# Altium schematic sheet Pizza BASE.SchDoc: Pizza CPU BASE
size A4; Author: Giovanni Minotti; SheetNumber: 1; SheetTotal: 2; ENG_APP_DATE: --/--/--; DSN_APP_DATE: --/--/--; CHK_APP_DATE: --/--/--
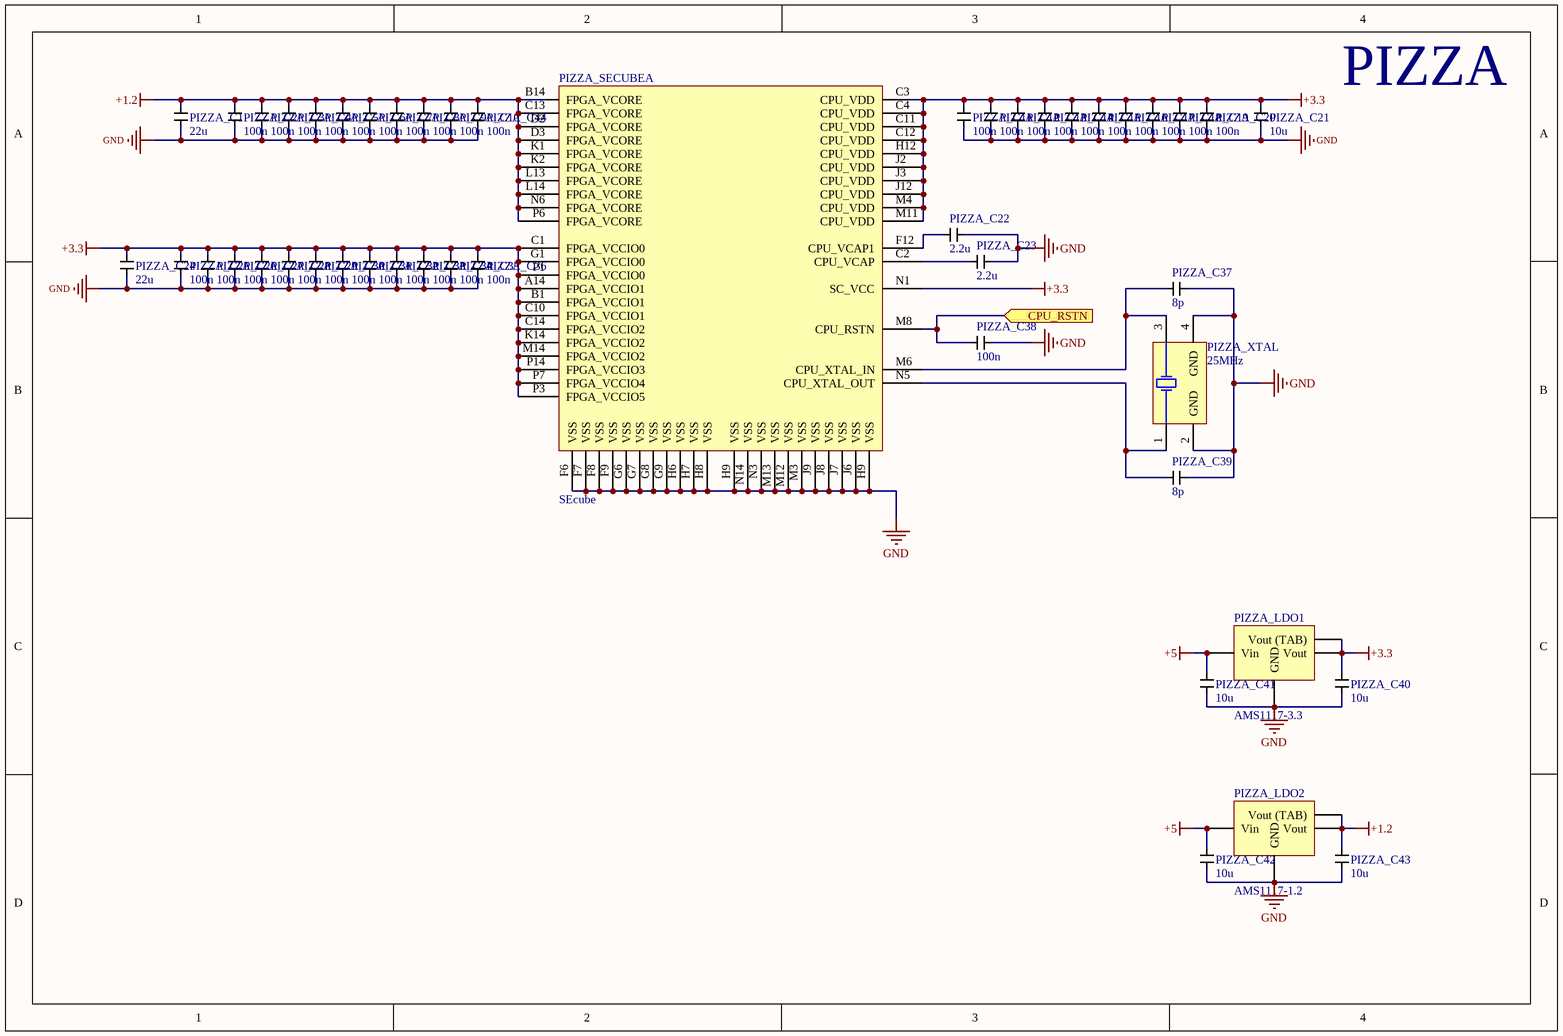
[diagram p0: Pizza BASE.SchDoc]

## Parts
PIZZA_C1  22u  [C0402]
PIZZA_C2  100n  [C0201]
PIZZA_C3  100n  [C0201]
PIZZA_C4  100n  [C0201]
PIZZA_C5  100n  [C0201]
PIZZA_C6  100n  [C0201]
PIZZA_C7  100n  [C0201]
PIZZA_C8  100n  [C0201]
PIZZA_C9  100n  [C0201]
PIZZA_C10  100n  [C0201]
PIZZA_C11  100n  [C0201]
PIZZA_C12  100n  [C0201]
PIZZA_C13  100n  [C0201]
PIZZA_C14  100n  [C0201]
PIZZA_C15  100n  [C0201]
PIZZA_C16  100n  [C0201]
PIZZA_C17  100n  [C0201]
PIZZA_C18  100n  [C0201]
PIZZA_C19  100n  [C0201]
PIZZA_C20  100n  [C0201]
PIZZA_C21  10u  [C0402]
PIZZA_C22  2.2u  [C0402]
PIZZA_C23  2.2u  [C0402]
PIZZA_C24  22u  [C0402]
PIZZA_C25  100n  [C0201]
PIZZA_C26  100n  [C0201]
PIZZA_C27  100n  [C0201]
PIZZA_C28  100n  [C0201]
PIZZA_C29  100n  [C0201]
PIZZA_C30  100n  [C0201]
PIZZA_C31  100n  [C0201]
PIZZA_C32  100n  [C0201]
PIZZA_C33  100n  [C0201]
PIZZA_C34  100n  [C0201]
PIZZA_C35  100n  [C0201]
PIZZA_C36  100n  [C0201]
PIZZA_C37  8p  [C0402]
PIZZA_C38  100n  [C0201]
PIZZA_C39  8p  [C0402]
PIZZA_C40  10u  [C0402]
PIZZA_C41  10u  [C0402]
PIZZA_C42  10u  [C0402]
PIZZA_C43  10u  [C0402]
PIZZA_C44  100n  [C0201]
PIZZA_LDO1  AMS1117-3.3  [SOT-223]
PIZZA_LDO2  AMS1117-1.2  [SOT-223]
PIZZA_SECUBE  SEcube  [SEcube]  (part A of 4)
PIZZA_XTAL  25MHz  [TSX-3225]

## Ports
CPU_RSTN (in, see Pizza IO[1C], Pizza IO[4D])

## Nets
+1.2: PIZZA_C1.2 PIZZA_C2.2 PIZZA_C3.2 PIZZA_C4.2 PIZZA_C5.2 PIZZA_C6.2 PIZZA_C7.2 PIZZA_C8.2 PIZZA_C9.2 PIZZA_C10.2 PIZZA_C43.2 PIZZA_C44.2 PIZZA_LDO2.3(Vout) PIZZA_LDO2.4(Vout_(TAB)) PIZZA_SECUBE.B14(FPGA_VCORE) PIZZA_SECUBE.C13(FPGA_VCORE) PIZZA_SECUBE.D2(FPGA_VCORE) PIZZA_SECUBE.D3(FPGA_VCORE) PIZZA_SECUBE.K1(FPGA_VCORE) PIZZA_SECUBE.K2(FPGA_VCORE) PIZZA_SECUBE.L13(FPGA_VCORE) PIZZA_SECUBE.L14(FPGA_VCORE) PIZZA_SECUBE.N6(FPGA_VCORE) PIZZA_SECUBE.P6(FPGA_VCORE)
+3.3: PIZZA_C11.2 PIZZA_C12.2 PIZZA_C13.2 PIZZA_C14.2 PIZZA_C15.2 PIZZA_C16.2 PIZZA_C17.2 PIZZA_C18.2 PIZZA_C19.2 PIZZA_C20.2 PIZZA_C21.2 PIZZA_C24.2 PIZZA_C25.2 PIZZA_C26.2 PIZZA_C27.2 PIZZA_C28.2 PIZZA_C29.2 PIZZA_C30.2 PIZZA_C31.2 PIZZA_C32.2 PIZZA_C33.2 PIZZA_C34.2 PIZZA_C35.2 PIZZA_C36.2 PIZZA_C40.2 PIZZA_LDO1.3(Vout) PIZZA_LDO1.4(Vout_(TAB)) PIZZA_SECUBE.A14(FPGA_VCCIO1) PIZZA_SECUBE.B1(FPGA_VCCIO1) PIZZA_SECUBE.C1(FPGA_VCCIO0) PIZZA_SECUBE.C3(CPU_VDD) PIZZA_SECUBE.C4(CPU_VDD) PIZZA_SECUBE.C10(FPGA_VCCIO1) PIZZA_SECUBE.C11(CPU_VDD) PIZZA_SECUBE.C12(CPU_VDD) PIZZA_SECUBE.C14(FPGA_VCCIO2) PIZZA_SECUBE.G1(FPGA_VCCIO0) PIZZA_SECUBE.H12(CPU_VDD) PIZZA_SECUBE.J2(CPU_VDD) PIZZA_SECUBE.J3(CPU_VDD) PIZZA_SECUBE.J12(CPU_VDD) PIZZA_SECUBE.K14(FPGA_VCCIO2) PIZZA_SECUBE.M4(CPU_VDD) PIZZA_SECUBE.M11(CPU_VDD) PIZZA_SECUBE.M14(FPGA_VCCIO2) PIZZA_SECUBE.N1(SC_VCC) PIZZA_SECUBE.P1(FPGA_VCCIO0) PIZZA_SECUBE.P3(FPGA_VCCIO5) PIZZA_SECUBE.P7(FPGA_VCCIO4) PIZZA_SECUBE.P14(FPGA_VCCIO3)
+5: PIZZA_C41.2 PIZZA_C42.2 PIZZA_LDO1.2(Vin) PIZZA_LDO2.2(Vin)
GND: PIZZA_C1.1 PIZZA_C2.1 PIZZA_C3.1 PIZZA_C4.1 PIZZA_C5.1 PIZZA_C6.1 PIZZA_C7.1 PIZZA_C8.1 PIZZA_C9.1 PIZZA_C10.1 PIZZA_C11.1 PIZZA_C12.1 PIZZA_C13.1 PIZZA_C14.1 PIZZA_C15.1 PIZZA_C16.1 PIZZA_C17.1 PIZZA_C18.1 PIZZA_C19.1 PIZZA_C20.1 PIZZA_C21.1 PIZZA_C22.1 PIZZA_C23.1 PIZZA_C24.1 PIZZA_C25.1 PIZZA_C26.1 PIZZA_C27.1 PIZZA_C28.1 PIZZA_C29.1 PIZZA_C30.1 PIZZA_C31.1 PIZZA_C32.1 PIZZA_C33.1 PIZZA_C34.1 PIZZA_C35.1 PIZZA_C36.1 PIZZA_C37.2 PIZZA_C38.1 PIZZA_C39.2 PIZZA_C40.1 PIZZA_C41.1 PIZZA_C42.1 PIZZA_C43.1 PIZZA_C44.1 PIZZA_LDO1.1(GND) PIZZA_LDO2.1(GND) PIZZA_SECUBE.F6(VSS) PIZZA_SECUBE.F7(VSS) PIZZA_SECUBE.F8(VSS) PIZZA_SECUBE.F9(VSS) PIZZA_SECUBE.G6(VSS) PIZZA_SECUBE.G7(VSS) PIZZA_SECUBE.G8(VSS) PIZZA_SECUBE.G9(VSS) PIZZA_SECUBE.H6(VSS) PIZZA_SECUBE.H7(VSS) PIZZA_SECUBE.H8(VSS) PIZZA_SECUBE.H9(VSS) PIZZA_SECUBE.J6(VSS) PIZZA_SECUBE.J7(VSS) PIZZA_SECUBE.J8(VSS) PIZZA_SECUBE.J9(VSS) PIZZA_SECUBE.M3(VSS) PIZZA_SECUBE.M12(VSS) PIZZA_SECUBE.M13(VSS) PIZZA_SECUBE.N3(VSS) PIZZA_SECUBE.N14(VSS) PIZZA_XTAL.2(GND) PIZZA_XTAL.4(GND)
CPU_RSTN: PIZZA_C38.2 PIZZA_SECUBE.M8(CPU_RSTN) ; port CPU_RSTN
NetPIZZA_C22_2: PIZZA_C22.2 PIZZA_SECUBE.F12(CPU_VCAP1)
NetPIZZA_C23_2: PIZZA_C23.2 PIZZA_SECUBE.C2(CPU_VCAP)
NetPIZZA_C37_1: PIZZA_C37.1 PIZZA_SECUBE.M6(CPU_XTAL_IN) PIZZA_XTAL.3(X2)
NetPIZZA_C39_1: PIZZA_C39.1 PIZZA_SECUBE.N5(CPU_XTAL_OUT) PIZZA_XTAL.1(X1)

## Notes on the sheet
- PIZZA
- DWG. NO.
- REV.
- SHT.
- THIS DOCUMENT AND THE DATA DISCLOSED HEREIN OR HEREWITH IS THE PROPERTY OF ALTIUM LIMITED AND MAY BE FREELY DISTRIBUTED IN WHOLE. NO RIGHTS ARE RESERVED OR EXPRESS OR IMPLIED WARANTEE GIVEN.
- REVISION
- DESCRIPTION
- DATE
- APPROVED
- ENG:
- APPROVALS
- PROJECT
- DSN:
- CHK:
- REFERENCE DOCUMENTS
- PROJECT REVISION:
- TITLE
- DOCUMENT REVISION:
- DESIGN ITEM:
- BOM:
- FAB DWG:
- PCB DWG:
- ASSY DWG:
- SCALE:
- SIZE
- B
- CAGE CODE
- FILE NAME
- DWG NO.
- SHEET
- OF
- REV

## Library data of the parts
PIZZA_C1-PIZZA_C44 = C
PIZZA_LDO1 PIZZA_LDO2 = LDO
PIZZA_XTAL = XTAL